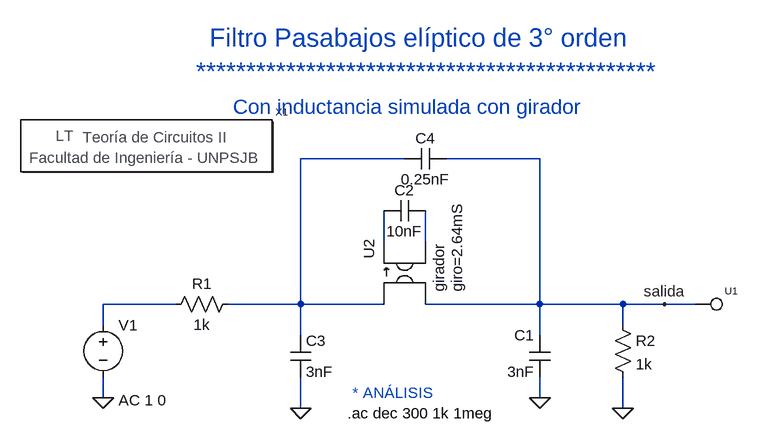
[diagram p0: schematic Filtro eliptico de 3 orden con girador.asc]
Filtro eliptico de 3 orden con girador.asc, the LTspice schematic file:
Version 4
SHEET 1 880 680
WIRE -1120 208 -1280 208
WIRE -912 208 -1056 208
WIRE -1152 336 -1152 288
WIRE -1088 336 -1088 288
WIRE -1472 432 -1584 432
WIRE -1280 432 -1280 208
WIRE -1280 432 -1392 432
WIRE -1152 432 -1280 432
WIRE -912 432 -912 208
WIRE -912 432 -1088 432
WIRE -784 432 -912 432
WIRE -720 432 -784 432
WIRE -672 432 -720 432
WIRE -1584 464 -1584 432
WIRE -784 464 -784 432
WIRE -1280 480 -1280 432
WIRE -912 480 -912 432
WIRE -1584 576 -1584 544
WIRE -912 576 -912 544
WIRE -1280 592 -1280 544
WIRE -784 592 -784 544
FLAG -1584 576 0
FLAG -720 432 salida
FLAG -912 576 0
FLAG -784 592 0
FLAG -1280 592 0
SYMBOL res -1376 416 R90
WINDOW 0 0 56 VBottom 2
WINDOW 3 32 56 VTop 2
SYMATTR InstName R1
SYMATTR Value 1k
SYMBOL cap -896 544 R180
WINDOW 0 24 64 Left 2
WINDOW 3 24 8 Left 2
SYMATTR InstName C1
SYMATTR Value 3nF
SYMBOL voltage -1584 448 R0
WINDOW 123 24 132 Left 2
WINDOW 39 0 0 Left 2
SYMATTR Value2 AC 1 0
SYMATTR InstName V1
SYMATTR Value ""
SYMBOL girador -1184 384 R270
WINDOW 3 -29 145 Left 2
SYMATTR Value giro=2.64mS
SYMATTR InstName U2
SYMBOL cap -1152 304 R270
WINDOW 0 32 32 VTop 2
WINDOW 3 0 32 VBottom 2
SYMATTR InstName C2
SYMATTR Value 10nF
SYMBOL cap -1296 480 R0
SYMATTR InstName C3
SYMATTR Value 3nF
SYMBOL cap -1056 192 R90
WINDOW 0 0 32 VBottom 2
WINDOW 3 32 32 VTop 2
SYMATTR InstName C4
SYMATTR Value 0.25nF
SYMBOL res -800 448 R0
SYMATTR InstName R2
SYMATTR Value 1k
SYMBOL Circuitos2\\Letreros\\Teoría\ de\ Circuitos\ II -1520 192 R0
SYMATTR InstName X1
SYMBOL Circuitos2\\Borneras\\Borne -656 432 R0
SYMATTR InstName U1
TEXT -1208 600 Left 2 !.ac dec 300 1k 1meg
TEXT -1200 568 Left 2 ;* ANÁLISIS
TEXT -1096 48 Center 4 ;Filtro Pasabajos elíptico de 3° orden\n**********************************************
TEXT -1384 128 Left 3 ;Con inductancia simulada con girador

The netlist it stands for:
* Filtro eliptico de 3 orden con girador.asc
R1 N001 N004 1k
C1 0 salida 3nF
V1 N004 0 AC 1 0
XU2 N001 salida N002 N003 girador giro=2.64mS  ; pins 1 2 3 4
C2 N002 N003 10nF
C3 N001 0 3nF
C4 salida N001 0.25nF
R2 salida 0 1k
XX1 Teoría de Circuitos II
XU1 salida borne  ; pins 1
.ac dec 300 1k 1meg
* * ANÁLISIS
* Filtro Pasabajos elíptico de 3° orden
* **********************************************
* Con inductancia simulada con girador
.lib ..\sym\Circuitos2\ComponentesIdeales\compoideales.lib
.lib ..\sym\Circuitos2\Borneras\borne.lib
.backanno
.end